# EAGLE design untitled (EAGLE 9.6.2)
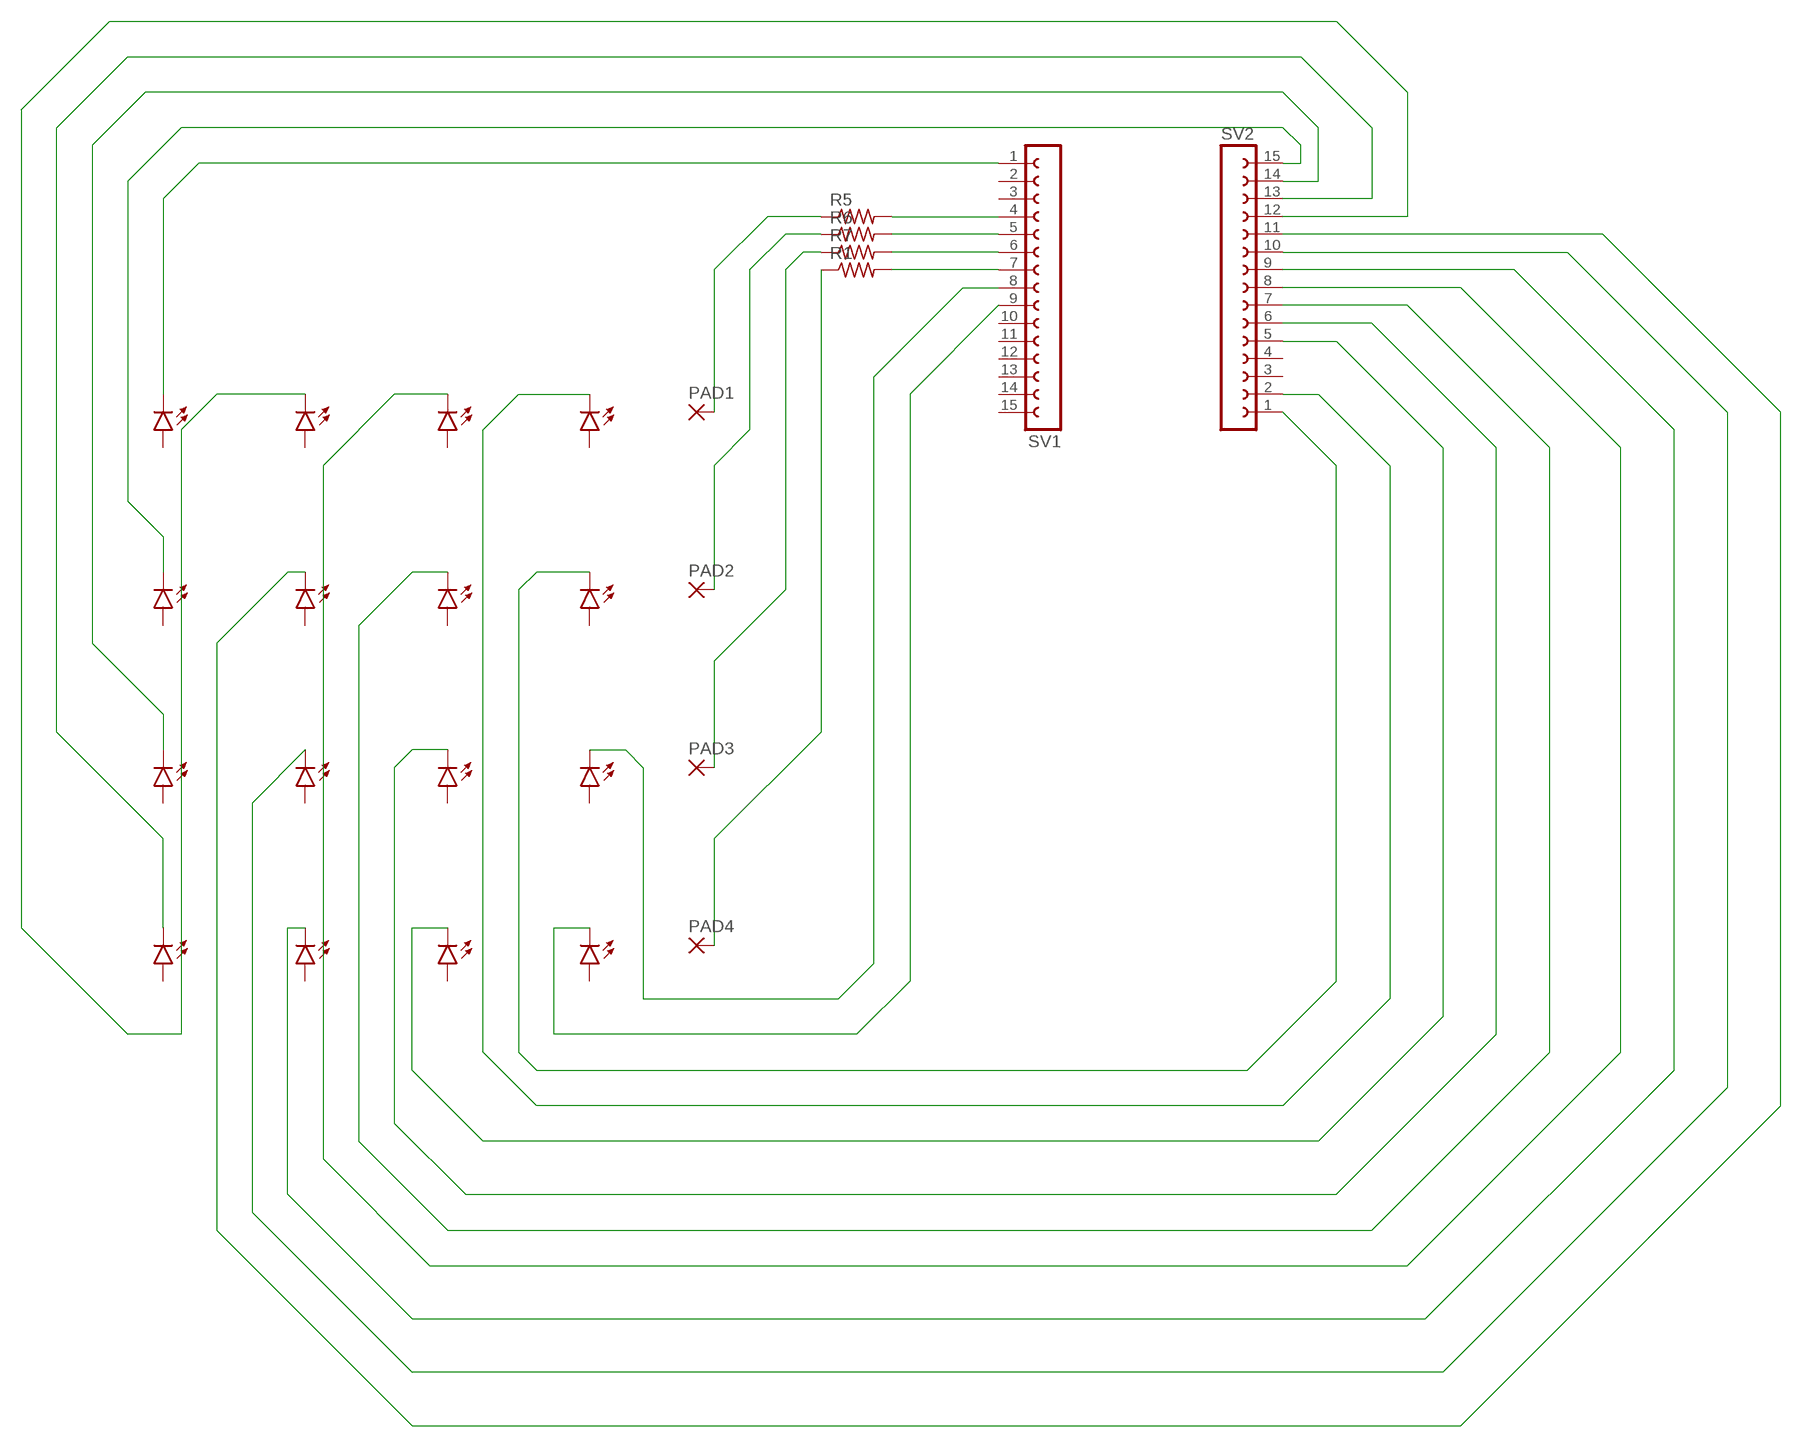
[diagram p0: schematic, sheet 1]

## Parts
LED1  LAP4-BOTTOM  [P47F-BOTTOM]
LED2  LAP4-BOTTOM  [P47F-BOTTOM]
LED3  LAP4-BOTTOM  [P47F-BOTTOM]
LED4  LAP4-BOTTOM  [P47F-BOTTOM]
LED5  LAP4-BOTTOM  [P47F-BOTTOM]
LED6  LAP4-BOTTOM  [P47F-BOTTOM]
LED7  LAP4-BOTTOM  [P47F-BOTTOM]
LED8  LAP4-BOTTOM  [P47F-BOTTOM]
LED9  LAP4-BOTTOM  [P47F-BOTTOM]
LED10  LAP4-BOTTOM  [P47F-BOTTOM]
LED11  LAP4-BOTTOM  [P47F-BOTTOM]
LED12  LAP4-BOTTOM  [P47F-BOTTOM]
LED13  LAP4-BOTTOM  [P47F-BOTTOM]
LED14  LAP4-BOTTOM  [P47F-BOTTOM]
LED15  LAP4-BOTTOM  [P47F-BOTTOM]
LED16  LAP4-BOTTOM  [P47F-BOTTOM]
PAD1  1,6/0,8  [1,6/0,8]
PAD2  1,6/0,8  [1,6/0,8]
PAD3  1,6/0,8  [1,6/0,8]
PAD4  1,6/0,8  [1,6/0,8]
R1  FLIPFLOP-RES  [0805-THM]
R5  FLIPFLOP-RES  [0805-THM]
R6  FLIPFLOP-RES  [0805-THM]
R7  FLIPFLOP-RES  [0805-THM]
SV1  FE15-1  [FE15]
SV2  FE15-1  [FE15]

## Nets
N$1: LED12.C SV1.1
N$2: LED10.C SV2.14
N$3: LED11.C SV2.15
N$4: LED16.C SV2.13
N$5: LED9.C SV2.12
N$6: R5.2 SV1.4
N$7: R6.2 SV1.5
N$8: R7.2 SV1.6
N$9: R1.2 SV1.7
N$10: LED3.C SV2.1
N$11: LED1.C SV1.8
N$12: LED13.C SV1.9
N$13: LED5.C SV2.2
N$14: LED14.C SV2.5
N$15: LED6.C SV2.8
N$16: LED2.C SV2.6
N$17: LED4.C SV2.7
N$18: LED15.C SV2.9
N$19: LED7.C SV2.10
N$20: PAD1.1(P) R5.1
N$21: LED8.C SV2.11
N$22: PAD2.1(P) R6.1
N$23: PAD3.1(P) R7.1
N$24: PAD4.1(P) R1.1
Unconnected: LED1.A LED2.A LED3.A LED4.A LED5.A LED6.A LED7.A LED8.A LED9.A LED10.A LED11.A LED12.A LED13.A LED14.A LED15.A LED16.A SV1.2 SV1.3 SV1.10 SV1.11 SV1.12 SV1.13 SV1.14 SV1.15 SV2.3 SV2.4

## Library data of the parts
LED1-LED16 = led:*P4: PointLED® Enhanced Thinfilm LED TOP & BOTTOM mount LS P47F, LR P47F, LA P47F, LY P47F, LT P4SG, LB P4SG, LW P4SG Source: http://catalog.osram-os.com .. LA_LR_LS_LY_P47F_Pb_free.pdf
PAD1-PAD4 = wirepad:1,6/0,8: THROUGH-HOLE PAD
R1 R5-R7 = adafruit:FLIPFLOP-RES: Flip Flop resistor An 0805 resistor inside a standard 1/4W 5% resistor. Makes for easy mods
SV1 SV2 = con-lsta:FE15-1: FEMALE HEADER; OC_FARNELL: unknown; OC_NEWARK: unknown

## Net classes
0 default: clearance 0.205 mm

## Board
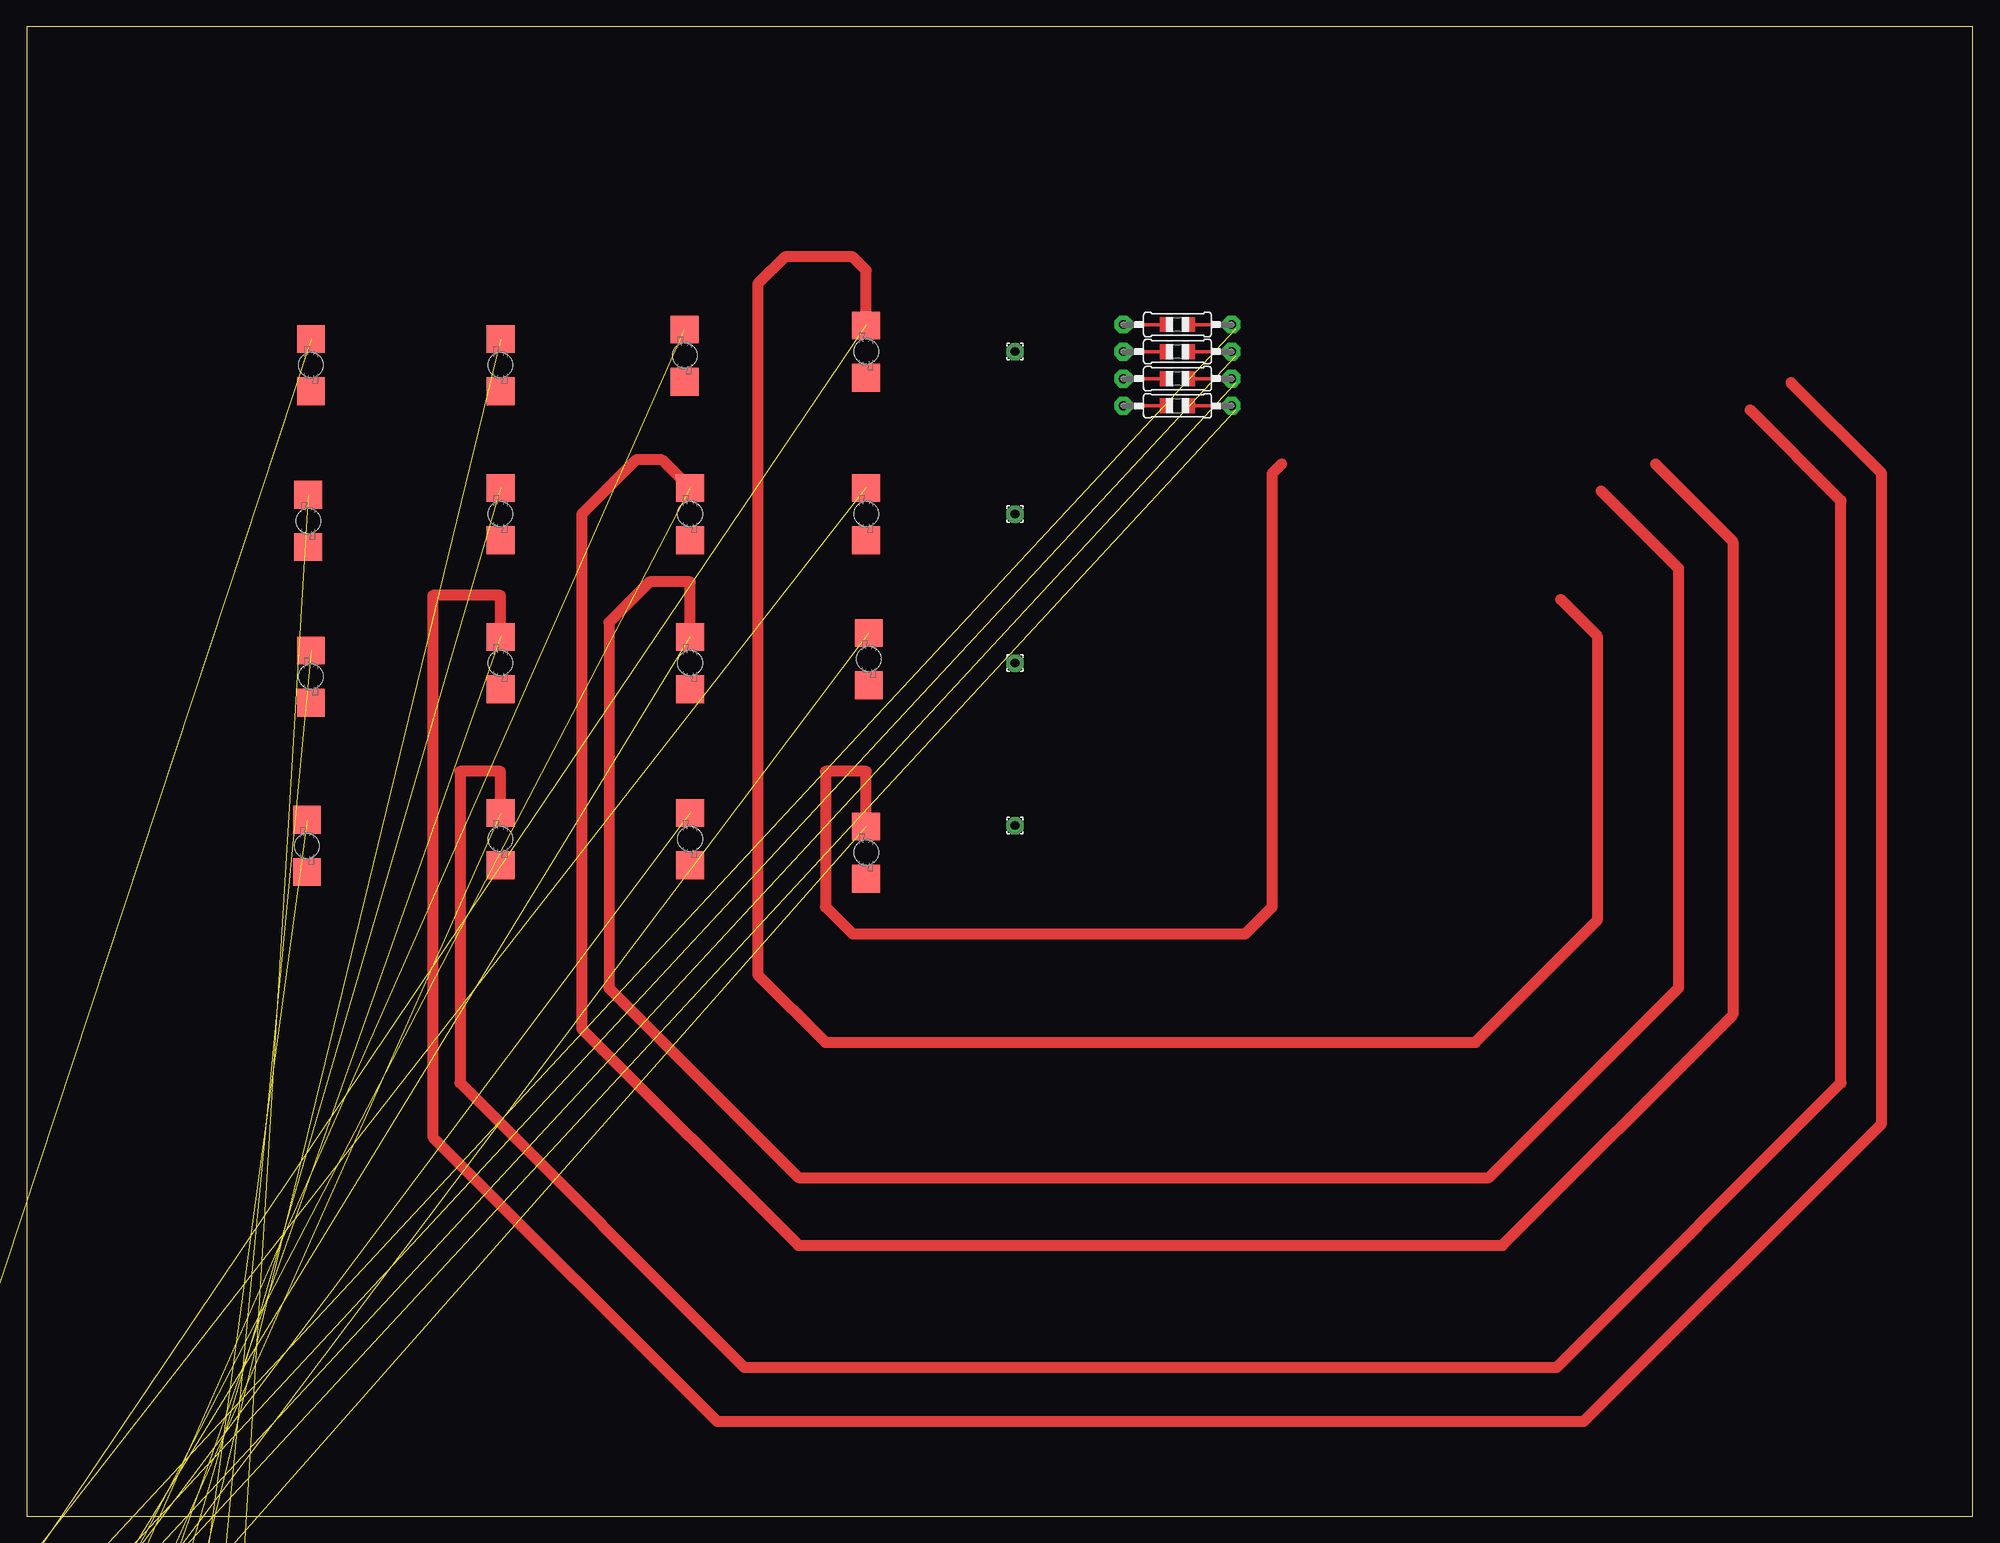
[diagram p1: board, top side]
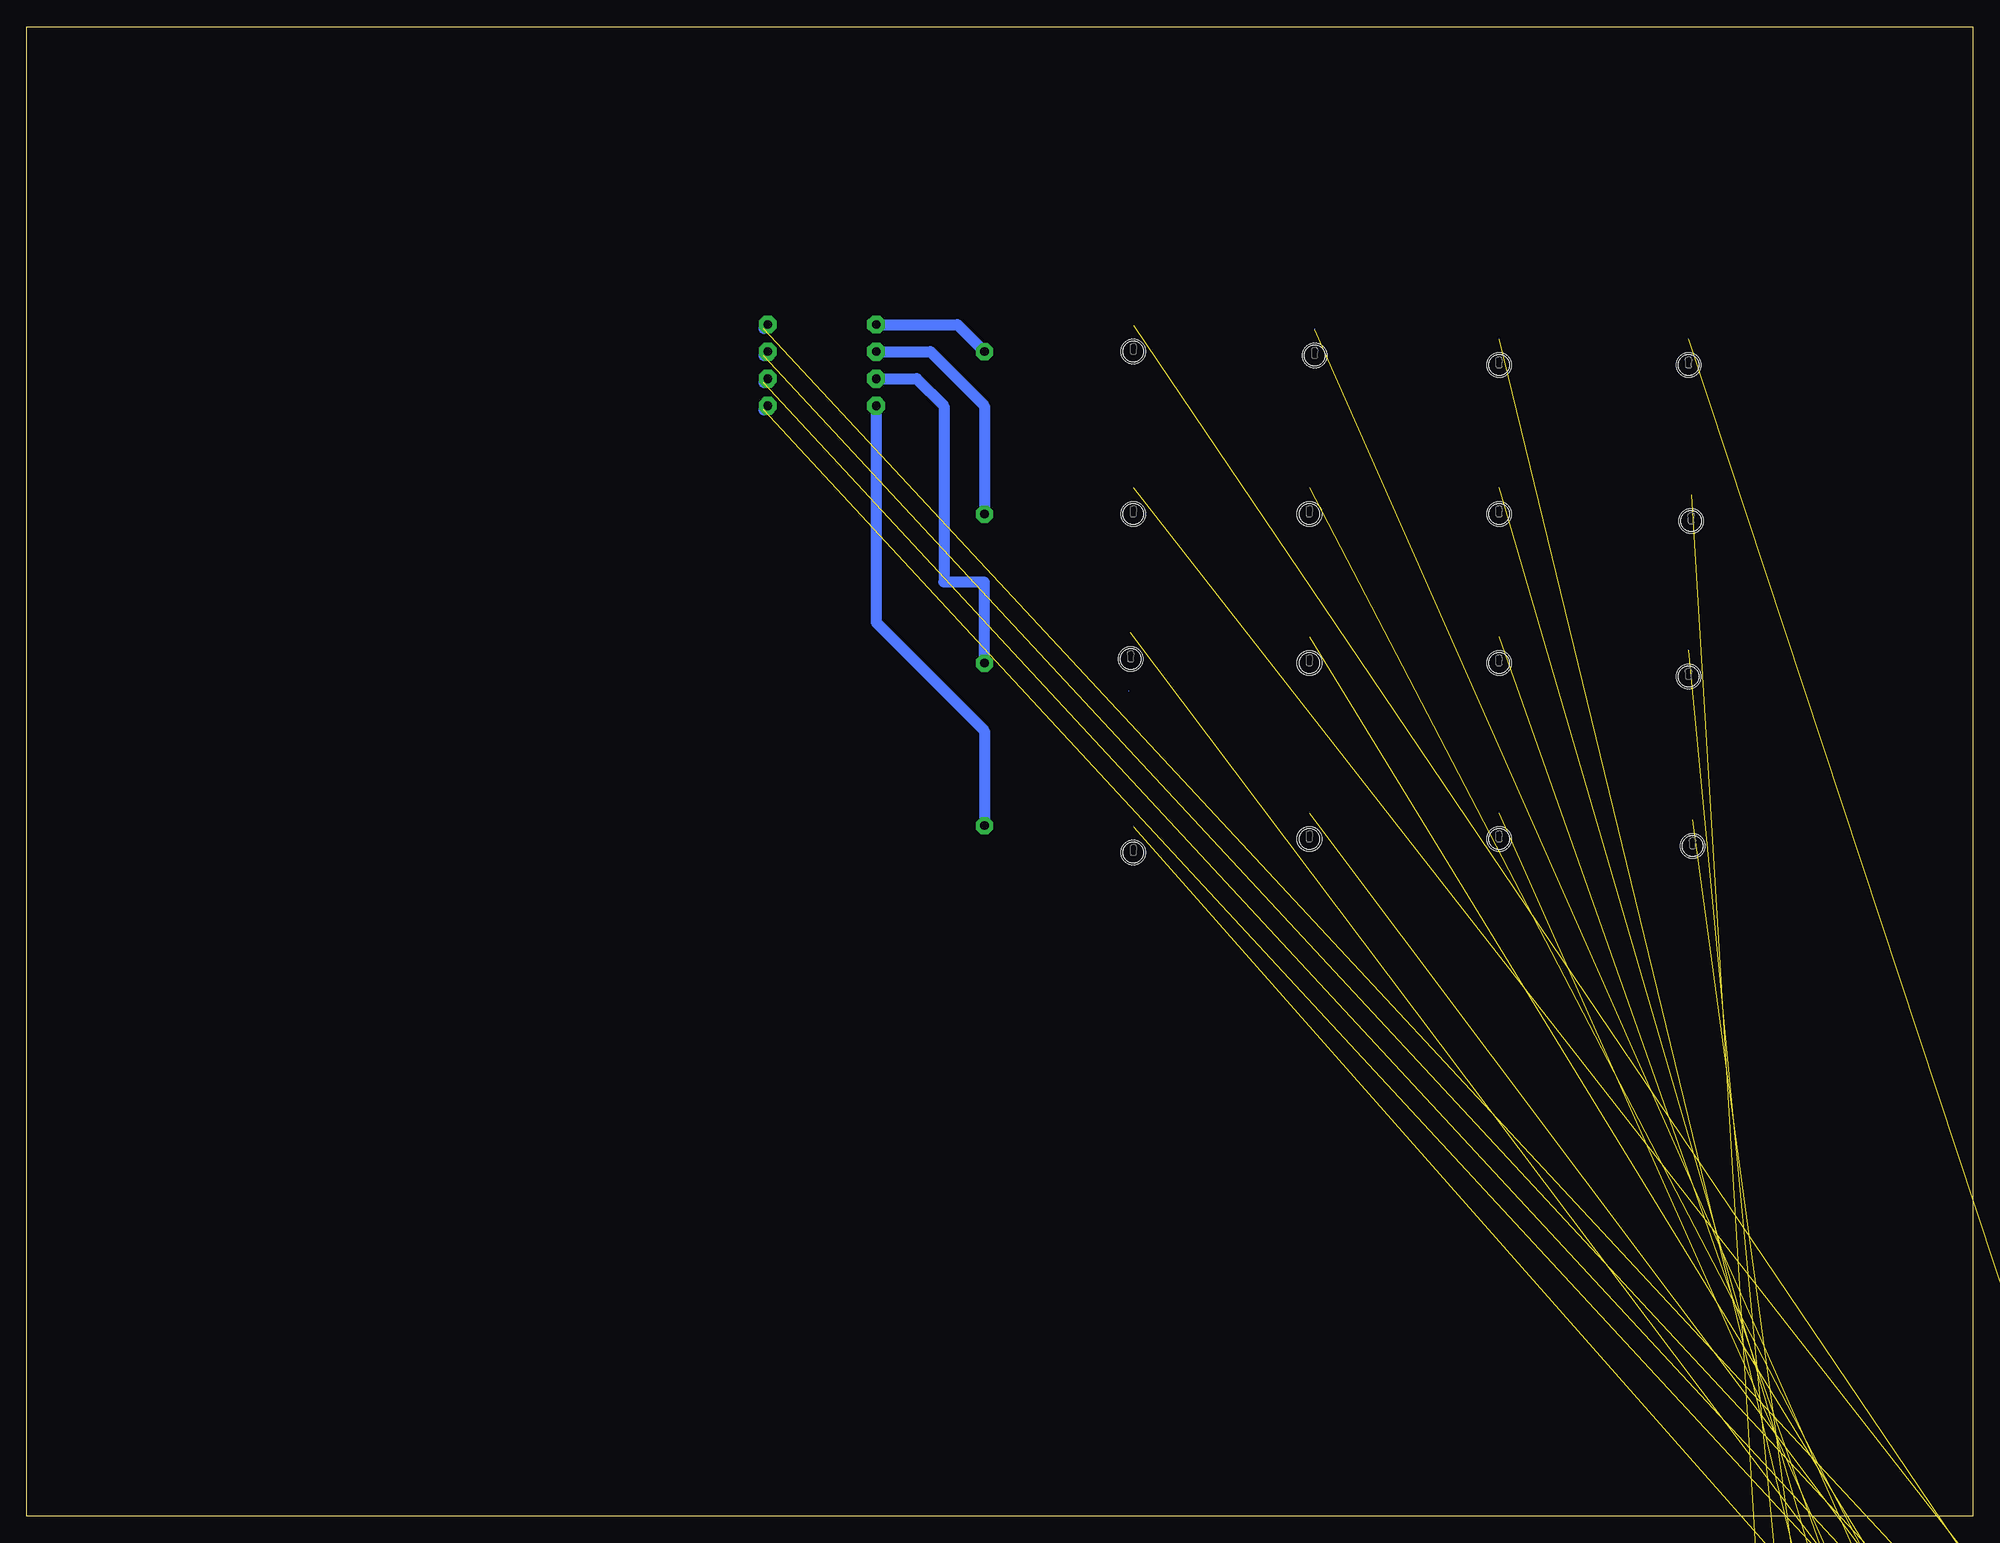
[diagram p2: board, bottom side, seen from below]

Size 182.55 x 139.69 mm. Coordinates in mm from the lower left corner, seen from the top.
Outline: 0,0 182.55,0 182.55,139.69 0,139.69 0,0
Copper layers (1*16): Top 0.035mm / dielectric 1.5mm / Bottom 0.035mm
Design rules "untitled": minimum track width 6mil, minimum drill 0.35mm, track to track 0.205mm, track to pad 0.205mm, pad to pad 0.205mm, via to via 0.205mm, smd to smd 6mil, copper to edge 40mil, drill to drill 6mil, minimum pad ring 10mil, minimum via ring 8mil, stop-mask expansion 4mil, vias tented up to drill 0mil, thermal gap 10mil

### Footprints (pad centres in the part's own frame; a part is rotated, then mirrored left to right if it is on the bottom)
P47F-BOTTOM = smd 2.6 x 2.6: A -2.45,0; C 2.45,0 | hole 2.3: 0,0
1,6/0,8 = drill 0.813 pad 1.6 octagon: 1 0,0
0805-THM = drill 0.813 pad 1.676 octagon: 1 -5.08,0; 2 5.08,0
FE15 = drill 0.813 long: 1 -17.78,0; 2 -15.24,0; 3 -12.7,0; 4 -10.16,0; 5 -7.62,0; 6 -5.08,0; 7 -2.54,0; 8 0,0; 9 2.54,0; 10 5.08,0; 11 7.62,0; 12 10.16,0; 13 12.7,0; 14 15.24,0; 15 17.78,0

### Placement (x,y rotation side)
DRILEGEND  [DRILEGEND]  0,-3.81 0 top  (outside the outline)
LED1  78.99,80.39 90 top
LED2  62.23,80.01 90 top
LED3  78.74,93.98 90 top
LED4  62.23,93.98 90 top
LED5  78.74,109.22 90 top
LED6  61.72,108.84 90 top
LED7  44.45,80.01 90 top
LED8  44.45,93.98 90 top
LED9  44.45,107.95 90 top
LED10  26.67,78.74 90 top
LED11  26.42,93.34 90 top
LED12  26.67,107.95 90 top
LED13  78.74,62.23 90 top
LED14  62.23,63.5 90 top
LED15  44.45,63.5 90 top
LED16  26.29,62.87 90 top
PAD1  92.71,109.22 0 top
PAD2  92.71,93.98 0 top
PAD3  92.71,80.01 0 top
PAD4  92.71,64.77 0 top
R1  107.95,104.14 0 top
R5  107.95,111.76 0 top
R6  107.95,109.22 0 top
R7  107.95,106.68 0 top
SV1  1.27,-20.32 0 top  (outside the outline)
SV2  1.27,-25.4 0 top  (outside the outline)

### Tracks (layer width: path | path; a pad name or v marks a point on that pad's centre or on a via)
N$1  (1 unrouted)
N$2  (1 unrouted)
N$3  (1 unrouted)
N$4  (1 unrouted)
N$5  (1 unrouted)
N$6  (1 unrouted)
  Bottom 1.016: 113.41,111.38 R5.2
N$7  (1 unrouted)
  Bottom 1.016: 113.41,108.84 R6.2
N$8  (1 unrouted)
  Bottom 1.016: 113.41,106.3 R7.2
N$9  (1 unrouted)
  Bottom 1.016: 113.41,103.76 R1.2
N$10  (1 unrouted)
N$11  (1 unrouted)
N$12  (1 unrouted)
  Top 1.016: LED13.C 78.74,69.85 74.93,69.85 74.93,57.15 77.47,54.61 114.3,54.61 116.84,57.15 116.84,97.79 117.73,98.68
N$13  (1 unrouted)
  Top 1.016: LED5.C 78.74,116.84 77.47,118.11 71.12,118.11 68.58,115.57 68.58,50.8 74.93,44.45 135.89,44.45 147.32,55.88 147.32,82.55 143.89,85.98
N$14  (1 unrouted)
N$15  (1 unrouted)
N$16  (1 unrouted)
  Top 1.016: LED2.C 62.23,87.63 58.42,87.63 54.61,83.82 54.61,49.53 72.39,31.75 137.16,31.75 154.94,49.53 154.94,88.9 147.7,96.14
N$17  (1 unrouted)
  Top 1.016: LED4.C 59.6,99.06 57.15,99.06 52.07,93.98 52.07,45.72 72.39,25.4 138.43,25.4 160.02,46.99 160.02,91.44 152.78,98.68
N$18  (1 unrouted)
  Top 1.016: LED15.C 44.45,69.85 40.64,69.85 40.64,40.64 67.31,13.97 143.51,13.97 170.18,40.64 170.18,95.25 161.67,103.76
N$19  (1 unrouted)
  Top 1.016: LED7.C 44.45,86.36 38.1,86.36 38.1,35.56 64.77,8.89 146.05,8.89 173.99,36.83 173.99,97.79 165.48,106.3
N$20
  Bottom 1.016: R5.1 95.25,111.76 PAD1.1
N$21  (1 unrouted)
N$22
  Bottom 1.016: R6.1 97.79,109.22 92.71,104.14 PAD2.1
N$23
  Bottom 1.016: R7.1 99.06,106.68 96.52,104.14 96.52,87.63 92.71,87.63 PAD3.1
N$24
  Bottom 1.016: R1.1 102.87,83.82 92.71,73.66 PAD4.1

### Text on the board
DrillLegend: LAYER-STACK
DrillLegend_01-16: 01-16
DrillLegend_01-20: 01-20